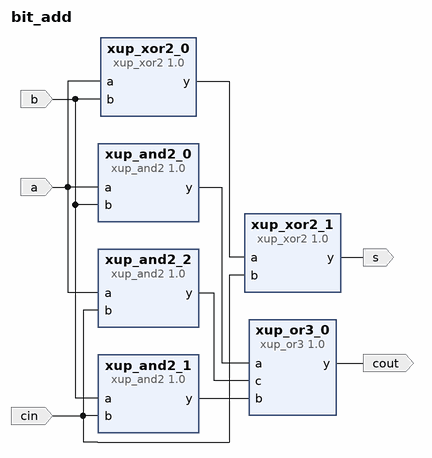
[diagram p0: block diagram of the top level]
# Vivado block design bit_add, xc7a100tcsg324-1, Vivado 2018.3
create_bd_design bit_add

create_bd_port -dir I a
create_bd_port -dir I b
create_bd_port -dir I cin
create_bd_port -dir O cout
create_bd_port -dir O s

create_bd_cell -type ip -vlnv xilinx.com:xup:xup_xor2:1.0 xup_xor2_0
create_bd_cell -type ip -vlnv xilinx.com:xup:xup_xor2:1.0 xup_xor2_1
create_bd_cell -type ip -vlnv xilinx.com:xup:xup_and2:1.0 xup_and2_0
create_bd_cell -type ip -vlnv xilinx.com:xup:xup_and2:1.0 xup_and2_1
create_bd_cell -type ip -vlnv xilinx.com:xup:xup_and2:1.0 xup_and2_2
create_bd_cell -type ip -vlnv xilinx.com:xup:xup_or3:1.0 xup_or3_0

# ---- connections ----

connect_bd_net [get_bd_pins xup_or3_0/y] [get_bd_ports cout]
connect_bd_net [get_bd_pins xup_xor2_1/y] [get_bd_ports s]
connect_bd_net [get_bd_ports a] [get_bd_pins xup_xor2_0/a] [get_bd_pins xup_and2_0/a] [get_bd_pins xup_and2_2/a]
connect_bd_net [get_bd_ports b] [get_bd_pins xup_xor2_0/b] [get_bd_pins xup_and2_0/b] [get_bd_pins xup_and2_1/a]
connect_bd_net [get_bd_ports cin] [get_bd_pins xup_and2_1/b] [get_bd_pins xup_and2_2/b] [get_bd_pins xup_xor2_1/b]
connect_bd_net [get_bd_pins xup_xor2_0/y] [get_bd_pins xup_xor2_1/a]
connect_bd_net [get_bd_pins xup_and2_0/y] [get_bd_pins xup_or3_0/a]
connect_bd_net [get_bd_pins xup_and2_1/y] [get_bd_pins xup_or3_0/b]
connect_bd_net [get_bd_pins xup_and2_2/y] [get_bd_pins xup_or3_0/c]

validate_bd_design
save_bd_design
